# EAGLE schematic uwbreceiver (EAGLE 8.6.0)
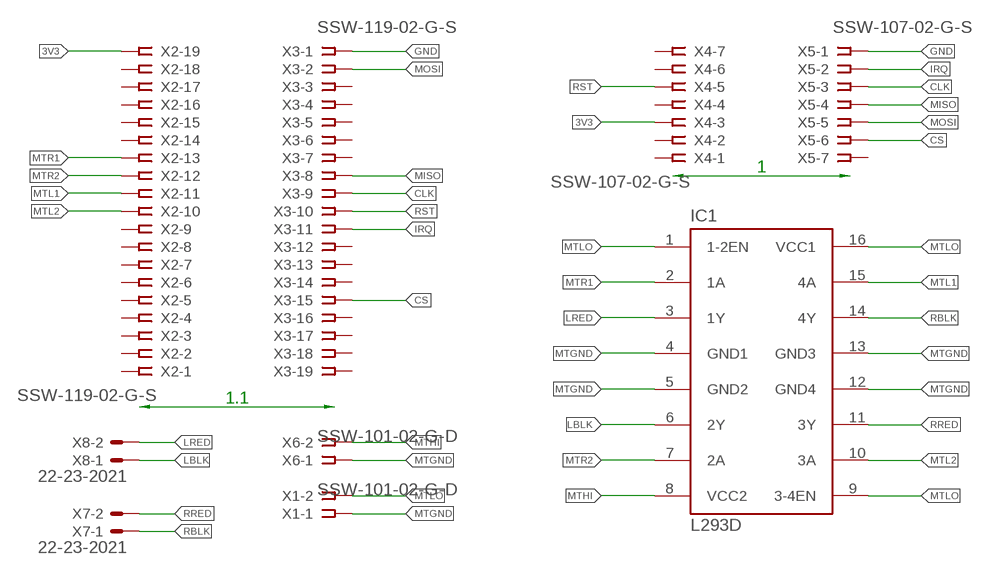
[diagram p0: schematic, sheet 1]

## Parts
IC1  L293D  [DIL16]
X1  SSW-101-02-G-D  [SSW-101-02-G-D]
X2  SSW-119-02-G-S  [SSW-119-02-G-S]
X3  SSW-119-02-G-S  [SSW-119-02-G-S]
X4  SSW-107-02-G-S  [SSW-107-02-G-S]
X5  SSW-107-02-G-S  [SSW-107-02-G-S]
X6  SSW-101-02-G-D  [SSW-101-02-G-D]
X7  22-23-2021  [22-23-2021]
X8  22-23-2021  [22-23-2021]

## Nets
3V3: X2.19 X4.3
CLK: X3.9 X5.3
CS: X3.15 X5.6
GND: X3.1 X5.1
IRQ: X3.11 X5.2
LBLK: IC1.6(2Y) X8.1
LRED: IC1.3(1Y) X8.2
MISO: X3.8 X5.4
MOSI: X3.2 X5.5
MTGND: IC1.4(GND1) IC1.5(GND2) IC1.12(GND4) IC1.13(GND3) X1.1 X6.1
MTHI: IC1.8(VCC2) X6.2
MTL1: IC1.15(4A) X2.11
MTL2: IC1.10(3A) X2.10
MTLO: IC1.1(1-2EN) IC1.9(3-4EN) IC1.16(VCC1) X1.2
MTR1: IC1.2(1A) X2.13
MTR2: IC1.7(2A) X2.12
RBLK: IC1.14(4Y) X7.1
RRED: IC1.11(3Y) X7.2
RST: X3.10 X4.5
Unconnected: X2.1 X2.2 X2.3 X2.4 X2.5 X2.6 X2.7 X2.8 X2.9 X2.14 X2.15 X2.16 X2.17 X2.18 X3.3 X3.4 X3.5 X3.6 X3.7 X3.12 X3.13 X3.14 X3.16 X3.17 X3.18 X3.19 X4.1 X4.2 X4.4 X4.6 X4.7 X5.7

## Library data of the parts
IC1 = st-microelectronics:L293D: PUSH-PULL 4 CHANNEL DRIVER; MPN: L293D; OC_FARNELL: 9589619; OC_NEWARK: 56P8249
X1 X6 = con-samtec:SSW-101-02-G: THROUGH-HOLE .025" SQ POST SOCKET Source: Samtec SSW.pdf; MF: Samtec Inc.; MPN: SSW-101-02-G-D; OC_FARNELL: unknown; OC_NEWARK: 82P1456
X2 X3 = con-samtec:SSW-119-02-G-S: THROUGH-HOLE .025" SQ POST SOCKET Source: Samtec SSW.pdf; MF: Samtec Inc.; MPN: SSW-119-02-G-S; OC_FARNELL: unknown; OC_NEWARK: 11P9625
X4 X5 = con-samtec:SSW-107-02-G-S: THROUGH-HOLE .025" SQ POST SOCKET Source: Samtec SSW.pdf; MF: Samtec Inc.; MPN: SSW-107-02-G-S; OC_FARNELL: unknown; OC_NEWARK: 11P9433
X7 X8 = con-molex:22-23-2021: .100" (2.54mm) Center Header - 2 Pin; MF: MOLEX; MPN: 22-23-2021; OC_FARNELL: 1462926; OC_NEWARK: 25C3832